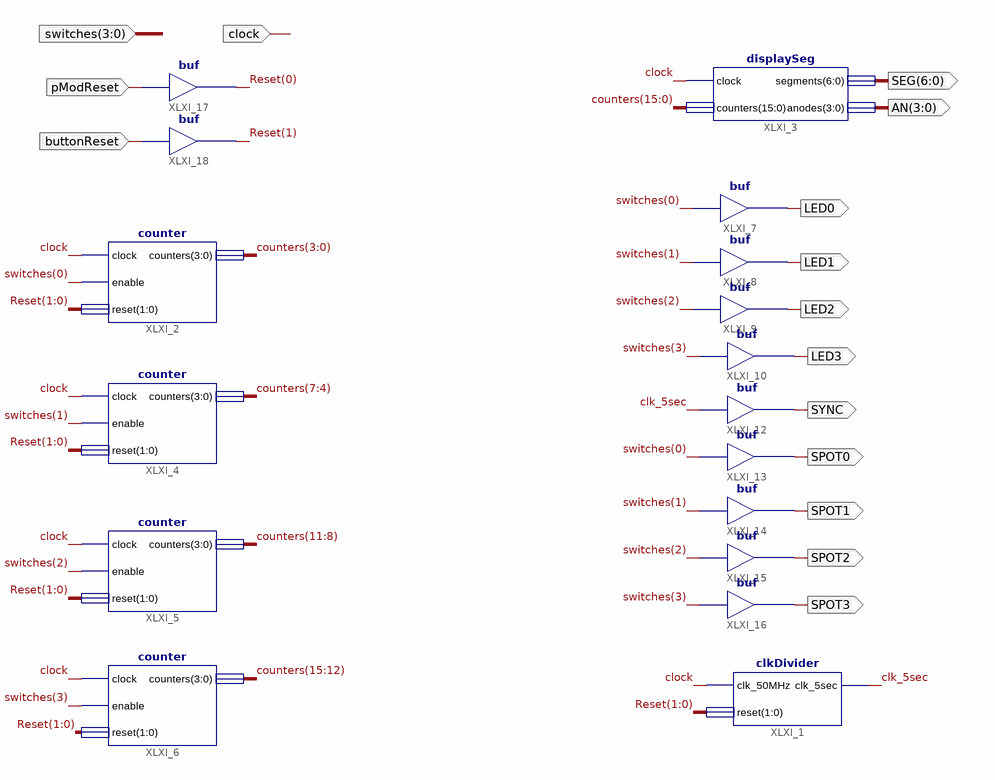
[diagram p0: schematic sheet 1]
// Xilinx ISE schematic Schematic.sch (spartan3e) as structural Verilog: 17 symbols, 15 ports
module Schematic (
  input  clock,
  input  pModReset,
  input  buttonReset,
  input  [3:0] switches,
  output [6:0] SEG,
  output [3:0] AN,
  output LED0,
  output LED1,
  output LED2,
  output LED3,
  output SYNC,
  output SPOT0,
  output SPOT1,
  output SPOT2,
  output SPOT3
);

  wire clk_5sec;
  wire [1:0] Reset;
  wire [15:0] counters;

  counter XLXI_2 (.clock(clock), .enable(switches[0]), .reset(Reset), .counters(counters[3:0]));
  counter XLXI_4 (.clock(clock), .enable(switches[1]), .reset(Reset), .counters(counters[7:4]));
  counter XLXI_5 (.clock(clock), .enable(switches[2]), .reset(Reset), .counters(counters[11:8]));
  counter XLXI_6 (.clock(clock), .enable(switches[3]), .reset(Reset), .counters(counters[15:12]));
  buf XLXI_7 (LED0, switches[0]);
  buf XLXI_8 (LED1, switches[1]);
  buf XLXI_9 (LED2, switches[2]);
  buf XLXI_10 (LED3, switches[3]);
  clkDivider XLXI_1 (.clk_50MHz(clock), .reset(Reset), .clk_5sec(clk_5sec));
  buf XLXI_12 (SYNC, clk_5sec);
  buf XLXI_13 (SPOT0, switches[0]);
  buf XLXI_14 (SPOT1, switches[1]);
  buf XLXI_15 (SPOT2, switches[2]);
  buf XLXI_16 (SPOT3, switches[3]);
  displaySeg XLXI_3 (.clock(clock), .counters(counters), .segments(SEG), .anodes(AN));
  buf XLXI_17 (Reset[0], pModReset);
  buf XLXI_18 (Reset[1], buttonReset);
endmodule
